# EAGLE design outsim nano (EAGLE 7.4.0)
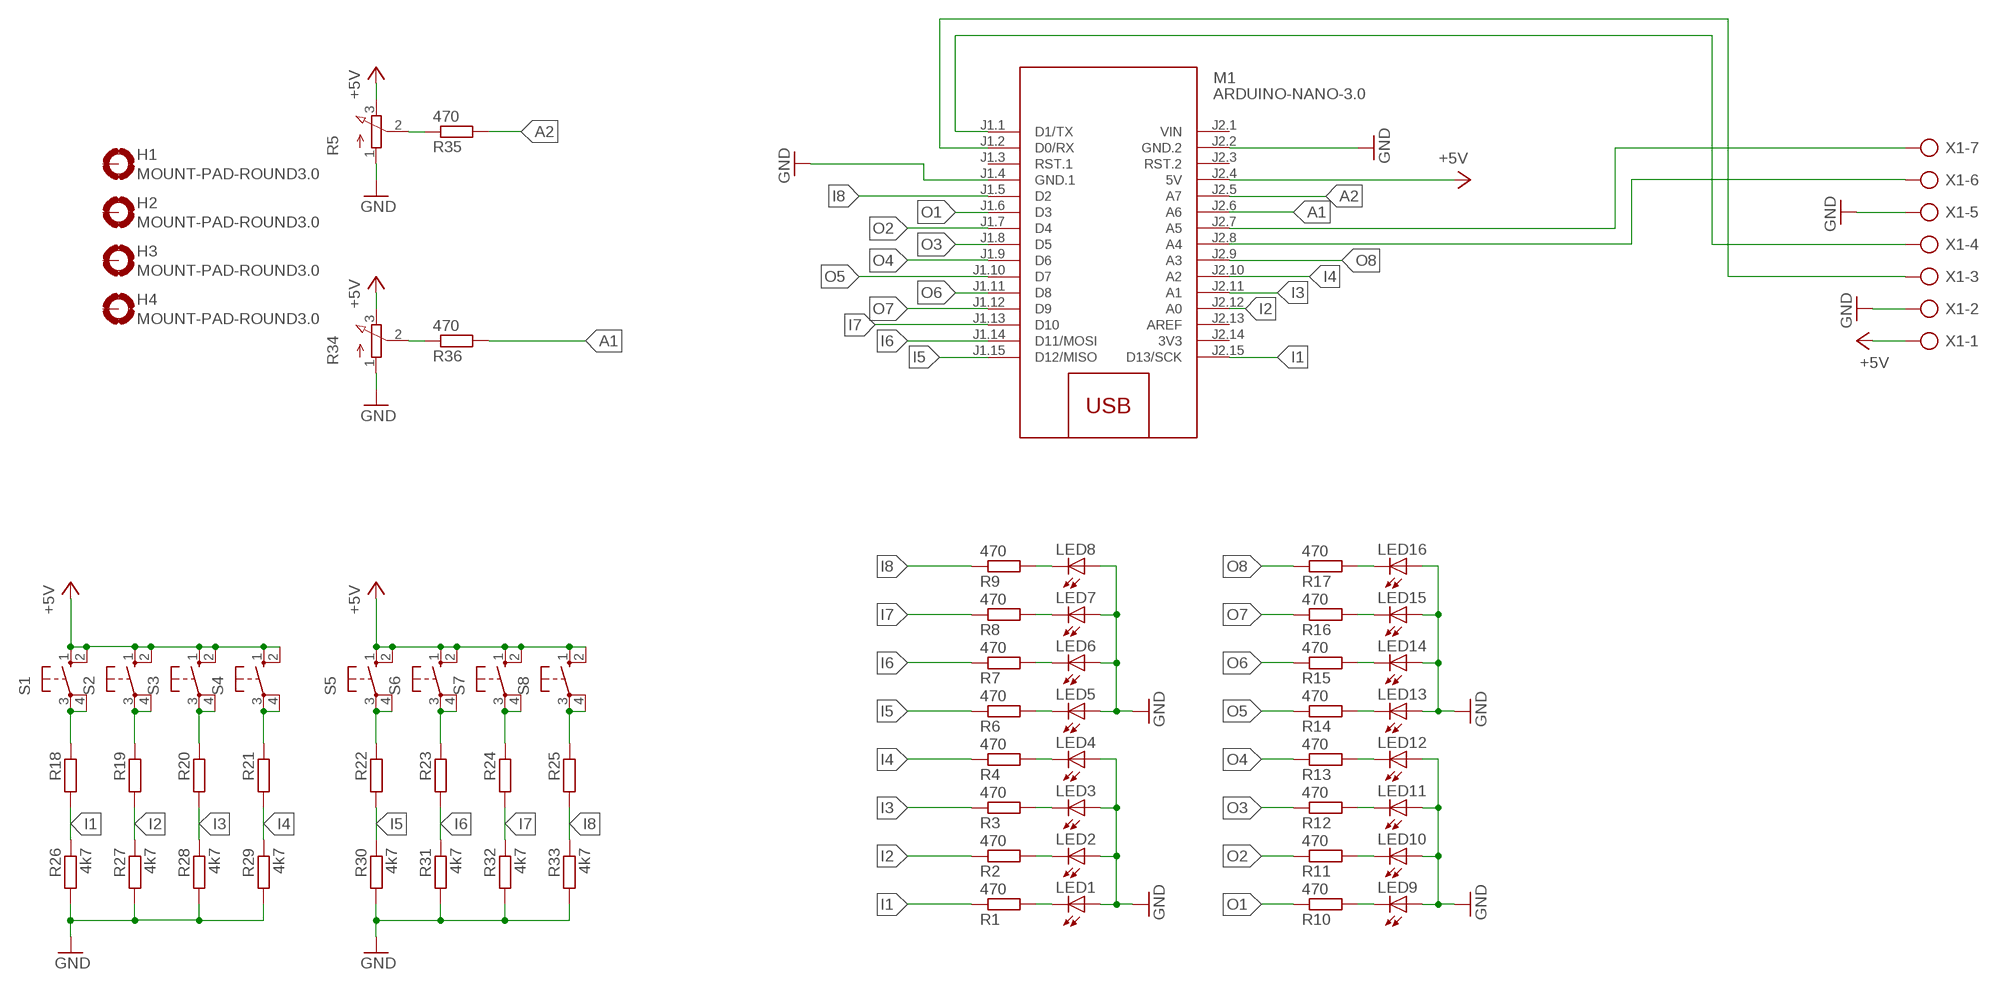
[diagram p0: schematic, sheet 1]

## Parts
H1  MOUNT-PAD-ROUND3.0  [3,0-PAD]
H2  MOUNT-PAD-ROUND3.0  [3,0-PAD]
H3  MOUNT-PAD-ROUND3.0  [3,0-PAD]
H4  MOUNT-PAD-ROUND3.0  [3,0-PAD]
LED1  LED5MM  [LED5MM]
LED2  LED5MM  [LED5MM]
LED3  LED5MM  [LED5MM]
LED4  LED5MM  [LED5MM]
LED5  LED5MM  [LED5MM]
LED6  LED5MM  [LED5MM]
LED7  LED5MM  [LED5MM]
LED8  LED5MM  [LED5MM]
LED9  LED5MM  [LED5MM]
LED10  LED5MM  [LED5MM]
LED11  LED5MM  [LED5MM]
LED12  LED5MM  [LED5MM]
LED13  LED5MM  [LED5MM]
LED14  LED5MM  [LED5MM]
LED15  LED5MM  [LED5MM]
LED16  LED5MM  [LED5MM]
M1  ARDUINO-NANO-3.0  [ARDUINO-NANO-3.0]
R1  470  R-EU_0207/10  [0207/10]
R2  470  R-EU_0207/10  [0207/10]
R3  470  R-EU_0207/10  [0207/10]
R4  470  R-EU_0207/10  [0207/10]
R5  3RP/1610N  [3RP/1610N]
R6  470  R-EU_0207/10  [0207/10]
R7  470  R-EU_0207/10  [0207/10]
R8  470  R-EU_0207/10  [0207/10]
R9  470  R-EU_0207/10  [0207/10]
R10  470  R-EU_0207/10  [0207/10]
R11  470  R-EU_0207/10  [0207/10]
R12  470  R-EU_0207/10  [0207/10]
R13  470  R-EU_0207/10  [0207/10]
R14  470  R-EU_0207/10  [0207/10]
R15  470  R-EU_0207/10  [0207/10]
R16  470  R-EU_0207/10  [0207/10]
R17  470  R-EU_0207/10  [0207/10]
R18  R-EU_0207/10  [0207/10]
R19  R-EU_0207/10  [0207/10]
R20  R-EU_0207/10  [0207/10]
R21  R-EU_0207/10  [0207/10]
R22  R-EU_0207/10  [0207/10]
R23  R-EU_0207/10  [0207/10]
R24  R-EU_0207/10  [0207/10]
R25  R-EU_0207/10  [0207/10]
R26  4k7  R-EU_0207/10  [0207/10]
R27  4k7  R-EU_0207/10  [0207/10]
R28  4k7  R-EU_0207/10  [0207/10]
R29  4k7  R-EU_0207/10  [0207/10]
R30  4k7  R-EU_0207/10  [0207/10]
R31  4k7  R-EU_0207/10  [0207/10]
R32  4k7  R-EU_0207/10  [0207/10]
R33  4k7  R-EU_0207/10  [0207/10]
R34  3RP/1610N  [3RP/1610N]
R35  470  R-EU_0207/10  [0207/10]
R36  470  R-EU_0207/10  [0207/10]
S1  10-XX  [B3F-10XX]
S2  10-XX  [B3F-10XX]
S3  10-XX  [B3F-10XX]
S4  10-XX  [B3F-10XX]
S5  10-XX  [B3F-10XX]
S6  10-XX  [B3F-10XX]
S7  10-XX  [B3F-10XX]
S8  10-XX  [B3F-10XX]
X1  AK300/7  [AK300/7]

## Nets
+5V: M1.J2.4(5V) R5.3(E) R34.3(E) S1.1(S) S1.2(S1) S2.1(S) S2.2(S1) S3.1(S) S3.2(S1) S4.1(S) S4.2(S1) S5.1(S) S5.2(S1) S6.1(S) S6.2(S1) S7.1(S) S7.2(S1) S8.1(S) S8.2(S1) X1.1
A1: M1.J2.6(A6) R36.2
A2: M1.J2.5(A7) R35.2
GND: LED1.A LED2.A LED3.A LED4.A LED5.A LED6.A LED7.A LED8.A LED9.A LED10.A LED11.A LED12.A LED13.A LED14.A LED15.A LED16.A M1.J1.4(GND.1) M1.J2.2(GND.2) R5.1(A) R26.2 R27.2 R28.2 R29.2 R30.2 R31.2 R32.2 R33.2 R34.1(A) X1.2 X1.5
I1: M1.J2.15(D13/SCK) R1.1 R18.2 R26.1
I2: M1.J2.12(A0) R2.1 R19.2 R27.1
I3: M1.J2.11(A1) R3.1 R20.2 R28.1
I4: M1.J2.10(A2) R4.1 R21.2 R29.1
I5: M1.J1.15(D12/MISO) R6.1 R22.2 R30.1
I6: M1.J1.14(D11/MOSI) R7.1 R23.2 R31.1
I7: M1.J1.13(D10) R8.1 R24.2 R32.1
I8: M1.J1.5(D2) R9.1 R25.2 R33.1
N$1: R34.2(S) R36.1
N$2: LED5.K(C) R6.2
N$3: LED6.K(C) R7.2
N$4: LED7.K(C) R8.2
N$5: LED1.K(C) R1.2
N$6: LED2.K(C) R2.2
N$7: LED3.K(C) R3.2
N$8: LED4.K(C) R4.2
N$9: M1.J1.1(D1/TX) X1.4
N$10: R20.1 S3.3(P) S3.4(P1)
N$11: LED8.K(C) R9.2
N$12: LED9.K(C) R10.2
N$13: LED10.K(C) R11.2
N$14: LED11.K(C) R12.2
N$15: LED12.K(C) R13.2
N$16: LED13.K(C) R14.2
N$17: R18.1 S1.3(P) S1.4(P1)
N$18: R19.1 S2.3(P) S2.4(P1)
N$19: LED14.K(C) R15.2
N$20: LED15.K(C) R16.2
N$21: LED16.K(C) R17.2
N$22: M1.J1.2(D0/RX) X1.3
N$23: R5.2(S) R35.1
N$26: M1.J2.8(A4) X1.6
N$27: M1.J2.7(A5) X1.7
N$28: R21.1 S4.3(P) S4.4(P1)
N$29: R22.1 S5.3(P) S5.4(P1)
N$30: R23.1 S6.3(P) S6.4(P1)
N$32: R24.1 S7.3(P) S7.4(P1)
N$36: R25.1 S8.3(P) S8.4(P1)
O1: M1.J1.6(D3) R10.1
O2: M1.J1.7(D4) R11.1
O3: M1.J1.8(D5) R12.1
O4: M1.J1.9(D6) R13.1
O5: M1.J1.10(D7) R14.1
O6: M1.J1.11(D8) R15.1
O7: M1.J1.12(D9) R16.1
O8: M1.J2.9(A3) R17.1
Unconnected: H1.B3,0(MOUNT) H2.B3,0(MOUNT) H3.B3,0(MOUNT) H4.B3,0(MOUNT) M1.J1.3(RST.1) M1.J2.3(RST.2) M1.J2.13(AREF)

## Power pins joined to a net without a drawn wire
3V3: M1.J2.14(3V3)
VIN: M1.J2.1(VIN)

## Library data of the parts
H1-H4 = holes:MOUNT-PAD-ROUND: MOUNTING PAD, round
LED1-LED16 = led:LED: LED OSRAM: - CHIPLED LG R971, LG N971, LY N971, LG Q971, LY Q971, LO R971, LY R971 LH N974, LH R974 LS Q976, LO Q976, LY Q976 LO Q996 - Hyper CHIPLED LW Q18S LB Q993, LB Q99A, LB R99A - SideLED LS A670, LO A670, LY A670, LG A670, LP A670 LB A673, LV A673, LT A673, LW A673 LH A674 LY A675 LS A676, LA A676, LO A676, LY A676, LW A676 LS A679, LY A679, LG A679 - Hyper Micro SIDELED® LS Y876, LA Y876, LO Y876, LY Y876 LT Y87S - SmartLED LW L88C, LW L88S LB L89C, LB L89S, LG L890 LS L89K, LO L89K, LY L89K LS L896, LA L896, LO L896, LY L896 - TOPLED LS T670, LO T670, LY T670, LG T670, LP T670 LSG T670, LSP T670, LSY T670, LOP T670, LYG T670 LG T671, LOG T671, LSG T671 LB T673, LV T673, LT T673, LW T673 LH T674 LS T676, LA T676, LO T676, LY T676, LB T676, LH T676, LSB T676, LW T676 LB T67C, LV T67C, LT T67C, LS T67K, LO T67K, LY T67K, LW E67C LS E67B, LA E67B, LO E67B, LY E67B, LB E67C, LV E67C, LT E67C LW T67C LS T679, LY T679, LG T679 LS T770, LO T770, LY T770, LG T770, LP T770 LB T773, LV T773, LT T773, LW T773 LH T774 LS E675, LA E675, LY E675, LS T675 LS T776, LA T776, LO T776, LY T776, LB T776 LHGB T686 LT T68C, LB T68C - Hyper Mini TOPLED® LB M676 - Mini TOPLED Santana® LG M470 LS M47K, LO M47K, LY M47K Source: http://www.osram.convergy.de LUXEON: - LUMILED® LXK2-PW12-R00, LXK2-PW12-S00, LXK2-PW14-U00, LXK2-PW14-V00 LXK2-PM12-R00, LXK2-PM12-S00, LXK2-PM14-U00 LXK2-PE12-Q00, LXK2-PE12-R00, LXK2-PE12-S00, LXK2-PE14-T00, LXK2-PE14-U00 LXK2-PB12-K00, LXK2-PB12-L00, LXK2-PB12-M00, LXK2-PB14-N00, LXK2-PB14-P00, LXK2-PB14-Q00 LXK2-PR12-L00, LXK2-PR12-M00, LXK2-PR14-Q00, LXK2-PR14-R00 LXK2-PD12-Q00, LXK2-PD12-R00, LXK2-PD12-S00 LXK2-PH12-R00, LXK2-PH12-S00 LXK2-PL12-P00, LXK2-PL12-Q00, LXK2-PL12-R00 Source: www.luxeon.com KINGBRIGHT: KA-3528ASYC Source: www.kingbright.com
M1 = nano:ARDUINO-NANO-3.0: Arduino Nano 3.0 and compatible devices More details available here: https://www.arduino.cc/en/Main/ArduinoBoardNano Click here to find device on ebay.com <http://www.ebay.com/sch/arduino+nano>
R1-R4 R6-R33 R35 R36 = rcl:R-EU_: RESISTOR, European symbol
R5 R34 = pot:3RP/1610N: 16mm Potentiometer one level Source: http://www.alphapotentiometers.net/html/16mm_pot_2.html
S1-S8 = switch-omron:10-XX: OMRON SWITCH; MPN: B3F-1000; OC_FARNELL: 176432; OC_NEWARK: 36M3542
X1 = con-ptr500:AK300/7: CONNECTOR; OC_FARNELL: unknown; OC_NEWARK: unknown

## Board
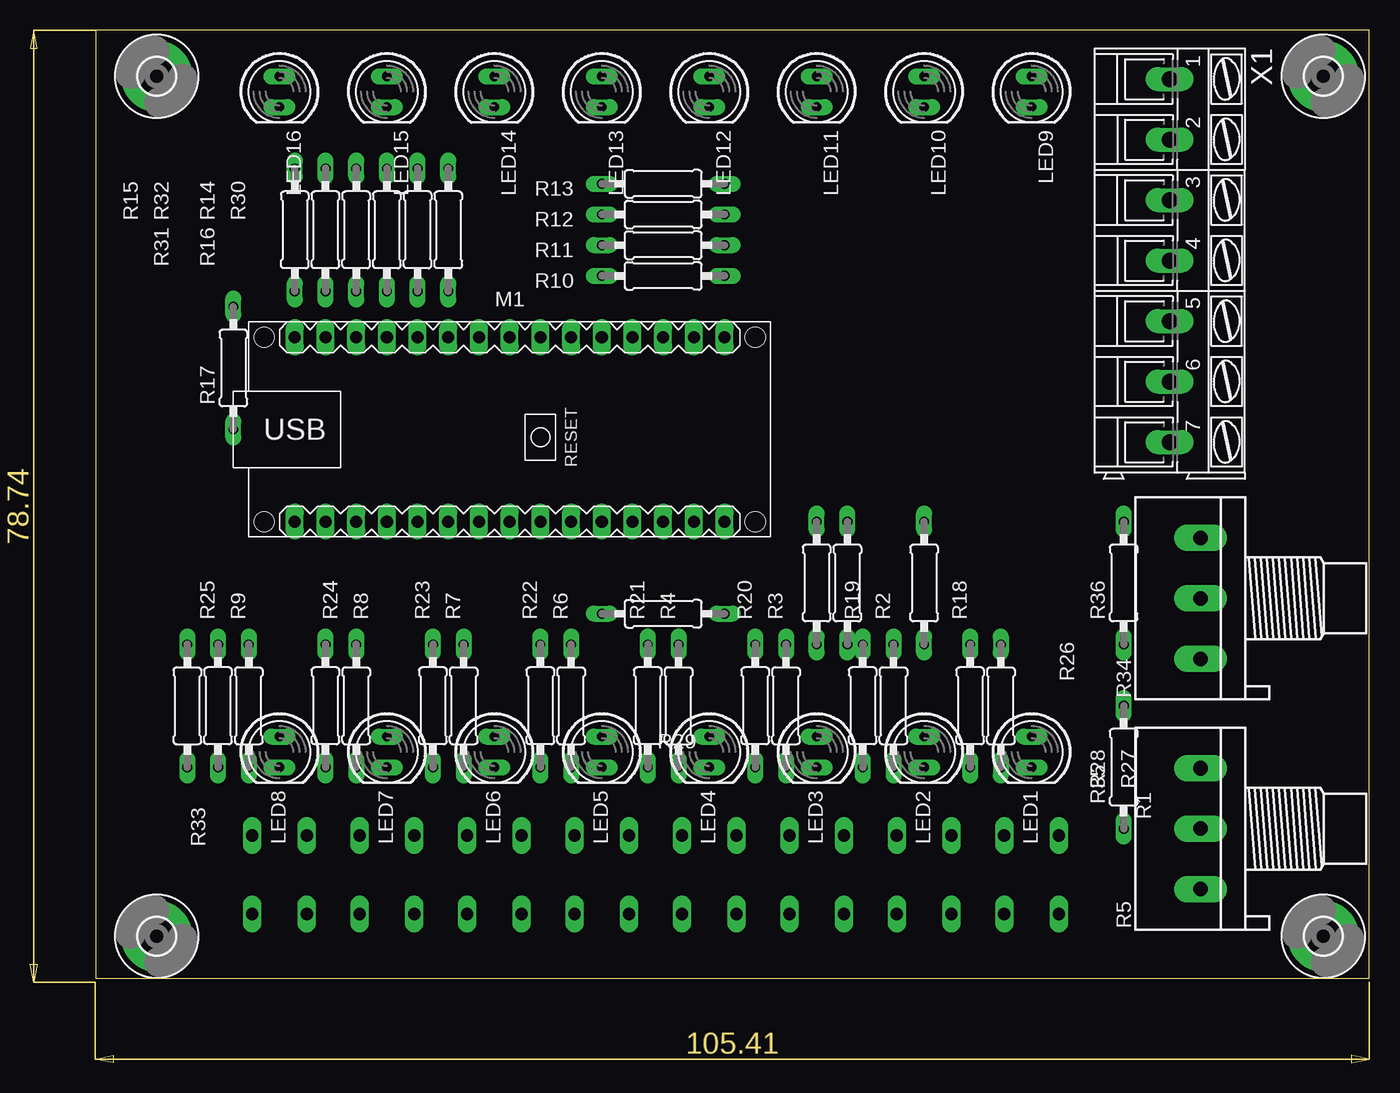
[diagram p1: board, top side]
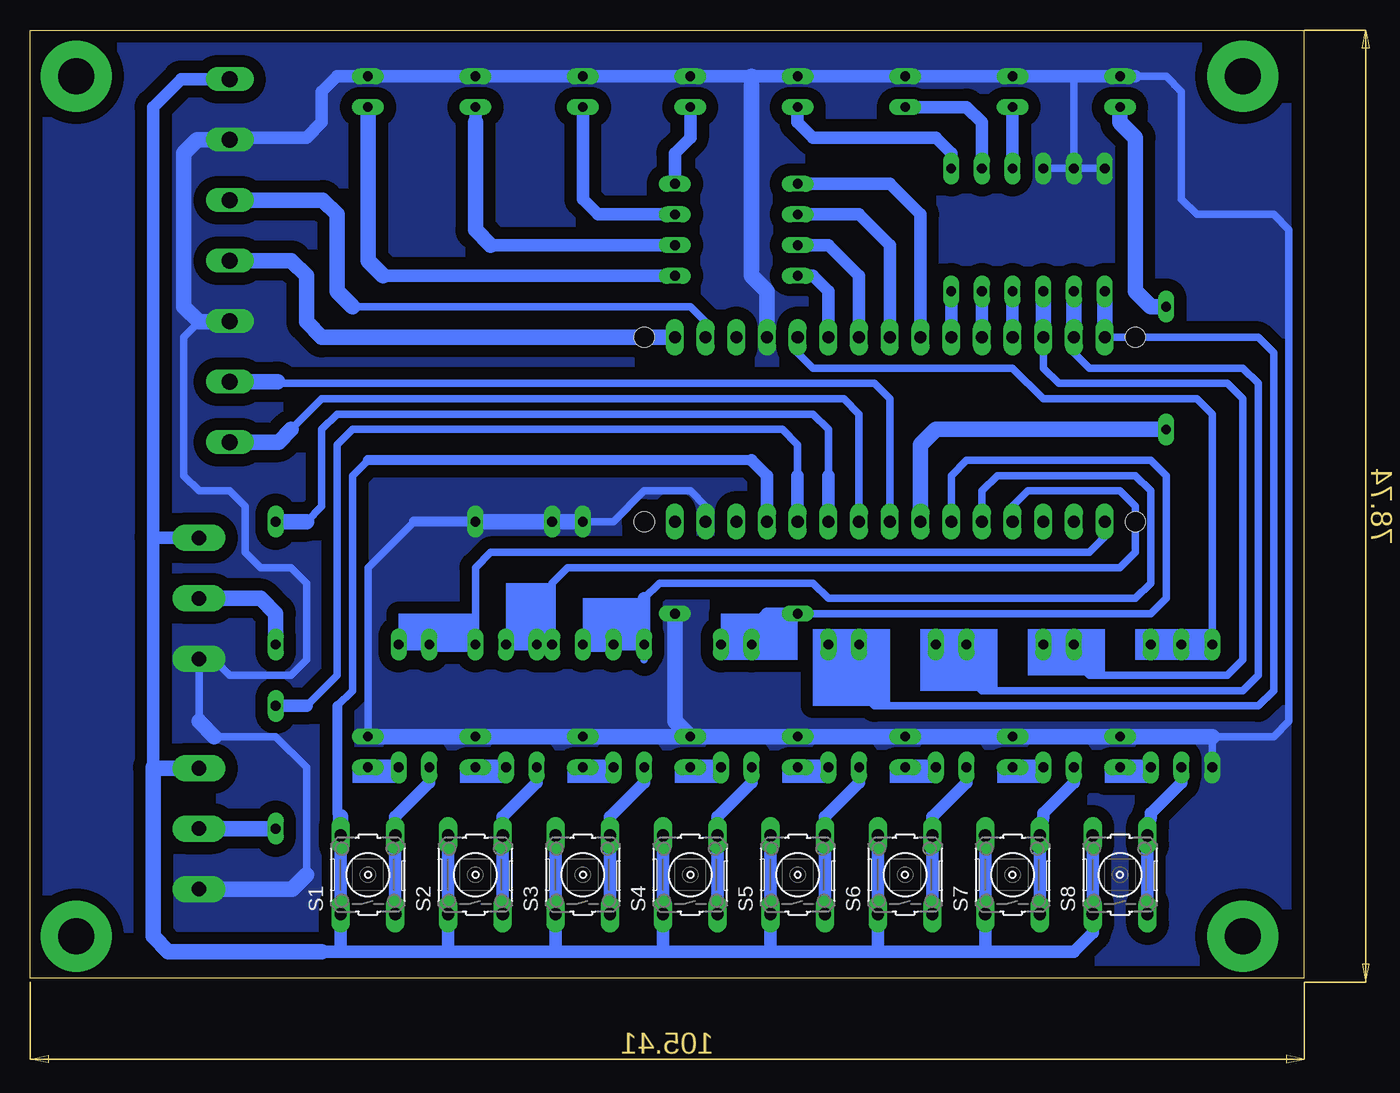
[diagram p2: board, bottom side, seen from below]

Size 105.39 x 78.41 mm. Coordinates in mm from the lower left corner, seen from the top.
Outline: 105.39,78.41 0,78.41 0,0 105.39,0 105.39,78.41
Copper layers (1*16): Top 0.035mm / dielectric 1.5mm / Bottom 0.035mm
Design rules "default": minimum track width 10mil, minimum drill 24mil, track to track 8mil, track to pad 8mil, pad to pad 8mil, via to via 8mil, smd to smd 8mil, copper to edge 40mil, drill to drill 8mil, minimum pad ring 10mil, minimum via ring 8mil, stop-mask expansion 4mil, vias tented up to drill 0mil, thermal gap 10mil

### Footprints (pad centres in the part's own frame; a part is rotated, then mirrored left to right if it is on the bottom)
3,0-PAD = drill 3 pad 5.842: B3,0 0,0
LED5MM = drill 0.813 long: A -1.27,0; K 1.27,0
ARDUINO-NANO-3.0 = drill 1 long: J1.1 17.78,7.62; J1.2 15.24,7.62; J1.3 12.7,7.62; J1.4 10.16,7.62; J1.5 7.62,7.62; J1.6 5.08,7.62; J1.7 2.54,7.62; J1.8 0,7.62; J1.9 -2.54,7.62; J1.10 -5.08,7.62; J1.11 -7.62,7.62; J1.12 -10.16,7.62; J1.13 -12.7,7.62; J1.14 -15.24,7.62; J1.15 -17.78,7.62; J2.1 17.78,-7.62; J2.2 15.24,-7.62; J2.3 12.7,-7.62; J2.4 10.16,-7.62; J2.5 7.62,-7.62; J2.6 5.08,-7.62; J2.7 2.54,-7.62; J2.8 0,-7.62; J2.9 -2.54,-7.62; J2.10 -5.08,-7.62; J2.11 -7.62,-7.62; J2.12 -10.16,-7.62; J2.13 -12.7,-7.62; J2.14 -15.24,-7.62; J2.15 -17.78,-7.62 | hole 1.651: -20.32,7.62; -20.32,-7.62; 20.32,-7.62; 20.32,7.62
0207/10 = drill 0.813 long: 1 -5.08,0; 2 5.08,0
3RP/1610N = drill 1.2 pad 2.184 long: 1 -5,0; 2 0,0; 3 5,0
B3F-10XX = drill 1.016 long: 1 -3.251,2.261; 2 3.251,2.261; 3 -3.251,-2.261; 4 3.251,-2.261
AK300/7 = drill 1.321 long: 1 -15.011,0; 2 -10.008,0; 3 -5.004,0; 4 0,0; 5 5.004,0; 6 10.008,0; 7 15.011,0

### Placement (x,y rotation side)
H1  101.58,3.48 90 top
H2  101.58,74.6 90 top
H3  5.06,74.6 90 top
H4  5.06,3.48 90 top
LED1  77.45,18.72 270 top
LED2  68.56,18.72 270 top
LED3  59.67,18.72 270 top
LED4  50.78,18.72 270 top
LED5  41.89,18.72 270 top
LED6  33,18.72 270 top
LED7  24.11,18.72 270 top
LED8  15.22,18.72 270 top
LED9  77.45,73.33 270 top
LED10  68.56,73.33 270 top
LED11  59.67,73.33 270 top
LED12  50.78,73.33 270 top
LED13  41.89,73.33 270 top
LED14  33,73.33 270 top
LED15  24.11,73.33 270 top
LED16  15.22,73.33 270 top
M1  34.27,45.39 0 top
R1  74.91,22.53 270 top
R2  66.02,22.53 270 top
R3  57.13,22.53 270 top
R4  48.24,22.53 270 top
R5  91.42,12.37 90 top
R6  39.35,22.53 270 top
R7  30.46,22.53 270 top
R8  21.57,22.53 270 top
R9  12.68,22.53 270 top
R10  46.97,58.09 0 top
R11  46.97,60.63 0 top
R12  46.97,63.17 0 top
R13  46.97,65.71 0 top
R14  29.19,61.9 90 top
R15  26.65,61.9 90 top
R16  24.11,61.9 90 top
R17  11.41,50.47 90 top
R18  72.37,22.53 90 top
R19  63.48,22.53 90 top
R20  54.59,22.53 90 top
R21  45.7,22.53 90 top
R22  36.81,22.53 90 top
R23  27.92,22.53 90 top
R24  19.03,22.53 90 top
R25  10.14,22.53 90 top
R26  68.56,32.69 90 top
R27  62.21,32.69 90 top
R28  59.67,32.69 90 top
R29  46.97,30.15 0 top
R30  16.49,61.9 90 top
R31  19.03,61.9 90 top
R32  21.57,61.9 90 top
R33  7.6,22.53 270 top
R34  91.42,31.42 90 top
R35  85.07,17.45 90 top
R36  85.07,32.69 90 top
S1  77.45,8.56 90 bottom
S2  68.56,8.56 90 bottom
S3  59.67,8.56 90 bottom
S4  50.78,8.56 90 bottom
S5  41.89,8.56 90 bottom
S6  33,8.56 90 bottom
S7  24.11,8.56 90 bottom
S8  15.22,8.56 90 bottom
X1  88.88,59.36 270 top

### Tracks (layer width: path | path; a pad name or v marks a point on that pad's centre or on a via)
+5V
  Bottom 0.61: 77.45,42.85 78.72,41.58 78.72,23.8 79.99,22.53
  Bottom 0.813: 45.7,42.85 77.45,42.85 | 79.99,22.53 79.99,13.64 79.71,13.36
  Bottom 1.016: S8.2 S8.1 17.48,3.76 19.03,2.21 26.65,2.21 | S7.2 S7.1 26.37,2.49 26.65,2.21 | S6.2 S6.1 35.26,2.49 35.54,2.21 | S5.2 S5.1 44.15,2.49 44.43,2.21 | S4.2 S4.1 53.04,2.49 53.32,2.21 | S2.2 S2.1 70.82,2.49 71.1,2.21 | S3.2 S3.1 61.93,2.49 62.21,2.21 | S1.2 S1.1 79.71,2.49 79.99,2.21 | 81.26,2.21 79.99,2.21 | 79.99,2.21 71.1,2.21 | 71.1,2.21 62.21,2.21 | 62.21,2.21 53.32,2.21 | 53.32,2.21 44.43,2.21 | 44.43,2.21 35.54,2.21 | 35.54,2.21 26.65,2.21 | 45.7,42.85 44.43,41.58 M1.J2.4 | X1.1 92.92,74.37 95.23,72.06 95.23,36.5 | 95.23,36.5 95.23,17.45 91.5,17.45 R5.3 | R34.3 95.15,36.42 95.23,36.5
  Bottom 1.27: S1.2 79.71,13.36 | R5.3 95.15,17.37 95.23,17.45 95.23,3.48 93.96,2.21 81.26,2.21
A1
  Bottom 0.61: 39.35,41.58 39.35,45.39 40.62,46.66 79.99,46.66 81.26,45.39 81.26,39.04 82.53,37.77
  Bottom 1.016: M1.J2.6 39.35,41.58
  Bottom 1.27: R36.2 82.53,37.77
A2
  Bottom 0.61: 41.89,41.58 41.89,44.12 43.16,45.39 78.72,45.39 79.99,44.12 79.99,25.07 82.53,22.53
  Bottom 1.016: M1.J2.5 41.89,41.58 | R35.2 82.53,22.53
GND
  Bottom 0.61: R32.2 R31.2 | R31.2 19.03,74.6 | R30.2 R31.2 | R33.2 7.6,19.99 2.52,19.99 1.25,21.26 1.25,61.9 2.52,63.17 8.87,63.17 10.14,64.44 10.14,73.33 11.41,74.6 13.95,74.6 | M1.J2.2 49.51,39.04 50.78,40.31 54.59,40.31 57.13,37.77 R28.2 | LED1.A 77.45,33.96 73.64,37.77 | 82.53,8.56 82.53,17.45 85.07,19.99 90.15,19.99 | 91.42,54.28 92.69,53.01 92.69,41.58 91.42,40.31 88.88,40.31 87.61,39.04 87.61,35.23 86.34,33.96 83.8,33.96 82.53,32.69 82.53,26.34 83.8,25.07 88.88,25.07 90.23,26.42 R34.1 91.42,21.26
  Bottom 0.813: R26.2 73.64,37.77
  Bottom 1.016: 13.95,74.6 LED16.A 19.03,74.6 LED15.A LED14.A LED13.A 45.7,74.6 LED12.A LED11.A LED10.A LED9.A 79.99,74.6 81.26,73.33 81.26,70.79 82.53,69.52 88.73,69.52 X1.2
  Bottom 1.27: LED1.A LED2.A LED3.A LED4.A | LED4.A LED5.A LED6.A LED7.A LED8.A 7.6,19.99 | R28.2 R27.2 R26.2 | R29.2 52.05,21.26 LED4.A | M1.J1.4 44.43,56.82 45.7,58.09 45.7,74.6 | 91.42,21.26 90.15,19.99 | R5.1 83.72,7.37 82.53,8.56 | X1.2 91.57,69.37 92.69,68.25 92.69,55.55 91.42,54.28 88.96,54.28 X1.5
  pour Bottom (isolate 1.016, no thermals): 107.93,80.95 -16.53,86.03 -16.53,-6.68 109.2,-2.87
I1
  Bottom 0.61: M1.J2.15 16.49,36.5 17.76,35.23 67.29,35.23 68.56,33.96 R26.1
  Bottom 1.016: R1.1 R18.2
  Bottom 1.27: R26.1 R18.2
I2
  Bottom 0.61: M1.J2.12 24.11,39.04 22.84,40.31 15.22,40.31 13.95,39.04 13.95,35.23 15.22,33.96 60.94,33.96 62.21,32.69 R27.1
  Bottom 1.016: R2.1 R19.2
  Bottom 1.27: R19.2 R27.1
I3
  Bottom 0.61: R20.2 54.59,26.34 | M1.J2.11 26.65,40.31 25.38,41.58 13.95,41.58 12.68,40.31 12.68,32.69 13.95,31.42 39.35,31.42 40.62,32.69 53.32,32.69 54.59,31.42
  Bottom 1.016: R3.1 R20.2 54.59,31.42
  Bottom 1.27: R3.1 R28.1
I4
  Bottom 0.61: M1.J2.10 29.19,41.58 27.92,42.85 12.68,42.85 11.41,41.58 11.41,31.42 12.68,30.15 R29.1
  Bottom 1.016: R4.1 R21.2 45.7,28.88 44.43,30.15 R29.1
I5
  Bottom 0.61: R22.2 36.81,23.8 35.54,22.53 3.79,22.53 2.52,23.8 2.52,51.74 3.79,53.01 M1.J1.15
  Bottom 1.27: R22.2 R6.1 | R30.1 M1.J1.15
I6
  Bottom 0.61: R23.2 27.92,25.07 26.65,23.8 5.06,23.8 3.79,25.07 3.79,49.2 5.06,50.47 17.76,50.47 19.03,51.74 M1.J1.14
  Bottom 1.016: R7.1 R23.2
  Bottom 1.27: R31.1 M1.J1.14
I7
  Bottom 0.61: M1.J1.13 21.57,50.47 20.3,49.2 6.33,49.2 5.06,47.93 5.06,26.34 6.33,25.07 17.76,25.07 19.03,26.34 R24.2
  Bottom 1.016: R8.1 R24.2
  Bottom 1.27: R32.1 M1.J1.13
I8
  Bottom 0.61: M1.J1.5 41.89,51.74 40.62,50.47 24.11,50.47 21.57,47.93 8.87,47.93 7.6,46.66 R33.1
  Bottom 1.016: R9.1 R25.2
  Bottom 1.27: R33.1 R25.2
N$1
  Bottom 1.27: R36.1 85.07,30.15 86.34,31.42 R34.2
N$2
  Bottom 1.27: R6.2 LED5.K
N$3
  Bottom 1.27: R7.2 LED6.K
N$4
  Bottom 1.27: LED7.K R8.2
N$5
  Bottom 1.27: LED1.K R1.2
N$6
  Bottom 1.27: LED2.K R2.2
N$7
  Bottom 1.27: LED3.K R3.2
N$8
  Bottom 1.27: LED4.K R4.2
N$9
  Bottom 1.27: M1.J1.1 81.26,53.01 82.53,54.28 82.53,58.09 83.8,59.36 X1.4
N$10
  Bottom 1.016: S3.3 S3.4 57.41,13.36 54.59,16.18 R20.1
N$11
  Bottom 1.27: R9.2 LED8.K
N$12
  Bottom 1.016: R10.2 76.18,58.09
  Bottom 1.27: LED9.K 77.45,59.36 76.18,58.09
N$13
  Bottom 1.016: LED10.K 68.56,70.79 | 67.29,60.63 R11.2
  Bottom 1.27: 68.56,70.79 68.56,61.9 67.29,60.63
N$14
  Bottom 1.016: R12.2 58.4,63.17 59.67,64.44 LED11.K
N$15
  Bottom 1.016: LED12.K 50.78,69.52 52.05,68.25 R13.2
N$16
  Bottom 1.016: R14.2 29.19,68.25 30.46,69.52 40.62,69.52 41.89,70.79 LED13.K
N$17
  Bottom 1.016: S1.3 S1.4 75.19,13.36 72.37,16.18 R18.1
N$18
  Bottom 1.016: S2.3 S2.4 66.3,13.36 63.48,16.18 R19.1
N$19
  Bottom 1.016: LED14.K 27.92,72.06 26.65,70.79 R15.2
N$20
  Bottom 1.016: LED15.K R16.2
N$21
  Bottom 1.27: LED16.K 15.22,70.79 13.95,69.52 13.95,56.82 12.68,55.55 R17.2
N$22
  Bottom 0.61: M1.J1.2 49.51,54.28 50.78,55.55 78.72,55.55
  Bottom 1.27: X1.3 81.18,64.36 79.99,63.17 79.99,56.82 78.72,55.55
N$23
  Bottom 1.27: R35.1 R5.2
N$26
  Bottom 0.61: M1.J2.8 34.27,47.93 35.54,49.2 84.92,49.2 85.07,49.35
  Bottom 1.27: X1.6 85.07,49.35 84.92,49.35
N$27
  Bottom 0.61: M1.J2.7 36.81,46.66 38.08,47.93 81.26,47.93 83.8,45.39
  Bottom 1.27: X1.7 84.84,44.35 83.8,45.39
N$28
  Bottom 1.016: S4.3 S4.4 48.52,13.36 45.7,16.18 R21.1
N$29
  Bottom 1.016: S5.3 S5.4 39.63,13.36 36.81,16.18 R22.1
N$30
  Bottom 1.016: S6.3 S6.4 30.74,13.36 27.92,16.18 R23.1
N$32
  Bottom 1.016: S7.3 S7.4 21.57,13.36 21.57,13.64 19.03,16.18 R24.1
N$36
  Bottom 1.016: S8.3 S8.4 12.68,13.36 12.68,13.64 10.14,16.18 R25.1
O1
  Bottom 1.016: R10.1 40.62,58.09 39.35,56.82 M1.J1.6
O2
  Bottom 1.016: R11.1 39.35,60.63 36.81,58.09 M1.J1.7
O3
  Bottom 1.016: R12.1 36.81,63.17 34.27,60.63 M1.J1.8
O4
  Bottom 1.016: M1.J1.9 31.73,63.17 34.27,65.71 R13.1
O5
  Bottom 1.016: R14.1 M1.J1.10
O6
  Bottom 1.016: M1.J1.11 R15.1
O7
  Bottom 1.016: R16.1 M1.J1.12
O8
  Bottom 1.27: R17.1 30.46,45.39 31.73,44.12 M1.J2.9
(copper drawn outside any net)
  shapes: Bottom area x16